# EAGLE design BusPirate-v4d (EAGLE 5.07)
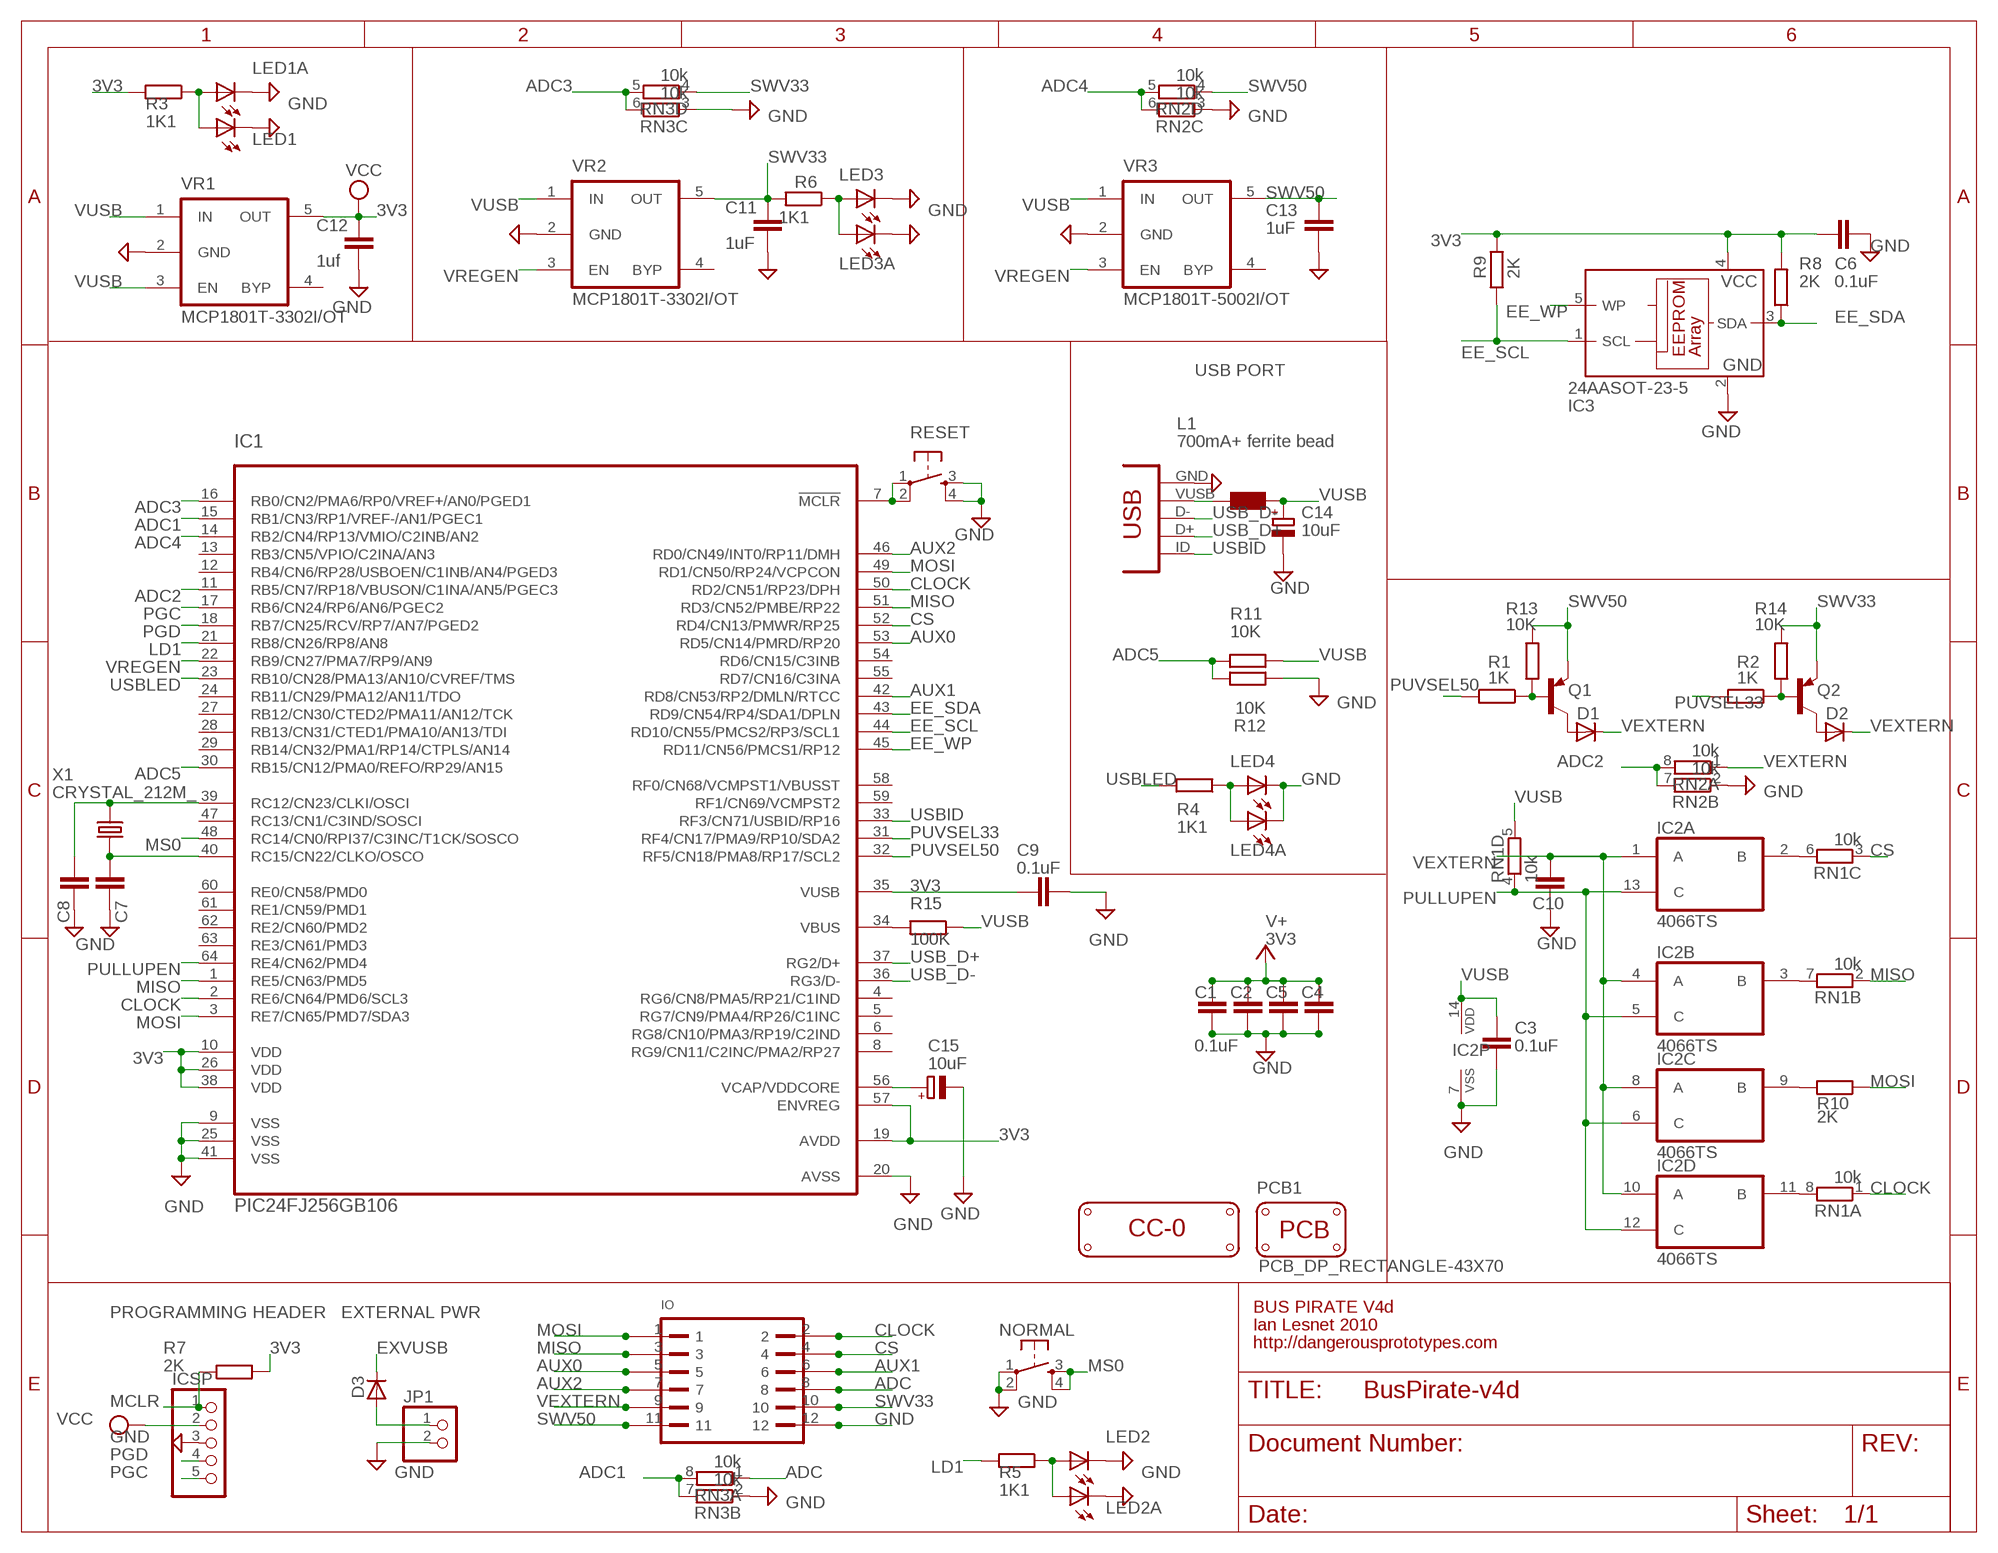
[diagram p0: schematic, sheet 1]

## Parts
C1  0.1uF  C-EUC0603  [C0603]
C2  0.1uF  C-EUC0603  [C0603]
C3  0.1uF  C-EUC0603  [C0603]
C4  0.1uF  C-EUC0603  [C0603]
C5  0.1uF  C-EUC0603  [C0603]
C6  0.1uF  C-EUC0603  [C0603]
C7  0.1uF  C-EUC0603  [C0603]
C8  0.1uF  C-EUC0603  [C0603]
C9  0.1uF  C-EUC0603  [C0603]
C10  0.1uF  C-EUC0603  [C0603]
C11  1uF  C-EUC0603  [C0603]
C12  1uf  C-EUC0603  [C0603]
C13  1uF  C-EUC0603  [C0603]
C14  10uF  CPOL-EUSMCA  [SMC_A]
C15  10uF  CPOL-EUSMCA  [SMC_A]
D1  MBR0520LT  [SOD123]
D2  MBR0520LT  [SOD123]
D3  MBR0520LT  [SOD123]
IC1  PIC24FJ256GB106  [TQFP64-10X10]
IC2  4066TS  [40XX_TSSOP14]
IC3  24AASOT-23-5  24AA  [SOT-23-5]
ICSP  PINHD-1X5  [1X05]
IO  PINSHRD-PTH-2X06  [PINSHRD_PTH_2X06]
JP1  PINHD-1X02_2.54-S  [1X02-S]
L1  700mA+ ferrite bead  WE-KIL_0805  [WE-KI_0805_B]
LED1  LEDCHIP-LED0805  [CHIP-LED0805]
LED1A  LEDCHIP-LED0805  [CHIP-LED0805]
LED2  LEDCHIP-LED0805  [CHIP-LED0805]
LED2A  LEDCHIP-LED0805  [CHIP-LED0805]
LED3  LEDCHIP-LED0805  [CHIP-LED0805]
LED3A  LEDCHIP-LED0805  [CHIP-LED0805]
LED4  LEDCHIP-LED0805  [CHIP-LED0805]
LED4A  LEDCHIP-LED0805  [CHIP-LED0805]
LOGO1  LOGO_CC-0  [LOGO_CC-0]
NORMAL  SMD_TACT_SMALL  [TACT_SWITCH_SMALL]
PCB1  PCB_DP_RECTANGLE-43X70  [DP7043_V1]
Q1  MMBTA56-SOT23  [SOT23]
Q2  MMBTA56-SOT23  [SOT23]
R1  1K  RESISTOR-0603  [R603]
R2  1K  R-EU_R0603  [R0603]
R3  1K1  RESISTOR-0603  [R603]
R4  1K1  RESISTOR-0603  [R603]
R5  1K1  RESISTOR-0603  [R603]
R6  1K1  RESISTOR-0603  [R603]
R7  2K  R-EU_R0603  [R0603]
R8  2K  R-EU_R0603  [R0603]
R9  2K  R-EU_R0603  [R0603]
R10  2K  R-EU_R0603  [R0603]
R11  10K  R-EU_R0603  [R0603]
R12  10K  R-EU_R0603  [R0603]
R13  10K  RESISTOR-0603  [R603]
R14  10K  R-EU_R0603  [R0603]
R15  100K  R-EU_R0603  [R0603]
RESET  SMD_TACT_SMALL  [TACT_SWITCH_SMALL]
RN1  10k  RNETWORK  [RN8P-4R-CRA06S]
RN2  10k  RNETWORK  [RN8P-4R-CRA06S]
RN3  10k  RNETWORK  [RN8P-4R-CRA06S]
USB  USB mini-b  CON-USB-MINI-BUSB1  [CONN_USB_MINI-B]
VR1  MCP1801T-3302I/OT  MIC5205  [SOT-23-5]
VR2  MCP1801T-3302I/OT  MIC5205  [SOT-23-5]
VR3  MCP1801T-5002I/OT  MIC5205  [SOT-23-5]
X1  CRYSTAL_212M_  [4X6]

## Nets
3V3: C1.1 C2.1 C4.1 C5.1 C6.1 C9.1 C12.1 IC1.10(VDD) IC1.19(AVDD) IC1.26(VDD) IC1.35(VUSB) IC1.38(VDD) IC1.57(ENVREG) IC3.4(VCC) ICSP.2 R3.2 R7.2 R8.2 R9.2 VR1.5(OUT) ; supply symbol labelled VCC, V+
ADC: IO.8 RN3.1
ADC1: IC1.15(RB1/CN3/RP1/VREF-/AN1/PGEC1) RN3.7 RN3.8
ADC2: IC1.11(RB5/CN7/RP18/VBUSON/C1INA/AN5/PGEC3) RN2.7 RN2.8
ADC3: IC1.16(RB0/CN2/PMA6/RP0/VREF+/AN0/PGED1) RN3.5 RN3.6
ADC4: IC1.14(RB2/CN4/RP13/VMIO/C2INB/AN2) RN2.5 RN2.6
ADC5: IC1.30(RB15/CN12/PMA0/REFO/RP29/AN15) R11.2 R12.2
AUX0: IC1.53(RD5/CN14/PMRD/RP20) IO.5
AUX1: IC1.42(RD8/CN53/RP2/DMLN/RTCC) IO.6
AUX2: IC1.46(RD0/CN49/INT0/RP11/DMH) IO.7
CLOCK: IC1.2(RE6/CN64/PMD6/SCL3) IC1.50(RD2/CN51/RP23/DPH) IO.2 RN1.1
CS: IC1.52(RD4/CN13/PMWR/RP25) IO.4 RN1.3
EE_SCL: IC1.44(RD10/CN55/PMCS2/RP3/SCL1) IC3.1(SCL) R9.1
EE_SDA: IC1.43(RD9/CN54/RP4/SDA1/DPLN) IC3.3(SDA) R8.1
EE_WP: IC1.45(RD11/CN56/PMCS1/RP12) IC3.5(WP)
EXVUSB: D3.C L1.2 USB.VUSB
GND: C1.2 C2.2 C3.2 C4.2 C5.2 C6.2 C7.2 C8.2 C9.2 C10.2 C11.2 C12.2 C13.2 C14.- C15.- IC1.9(VSS) IC1.20(AVSS) IC1.25(VSS) IC1.41(VSS) IC2.7(P:VSS) IC3.2(GND) ICSP.3 IO.12 JP1.2 LED1.C LED1A.C LED2.C LED2A.C LED3.C LED3A.C LED4.C LED4A.C NORMAL.1 NORMAL.2 R12.1 RESET.3 RESET.4 RN2.2 RN2.3 RN3.2 RN3.3 USB.GND VR1.2(GND) VR2.2(GND) VR3.2(GND)
LD1: IC1.21(RB8/CN26/RP8/AN8) R5.2
MCLR: IC1.7(!MCLR) ICSP.1 R7.1 RESET.1 RESET.2
MISO: IC1.1(RE5/CN63/PMD5) IC1.51(RD3/CN52/PMBE/RP22) IO.3 RN1.2
MOSI: IC1.3(RE7/CN65/PMD7/SDA3) IC1.49(RD1/CN50/RP24/VCPCON) IO.1 R10.1
MS0: IC1.48(RC14/CN0/RPI37/C3INC/T1CK/SOSCO) NORMAL.3 NORMAL.4
N$1: IC2.9(C:B) R10.2
N$2: IC2.11(D:B) RN1.8
N$3: D1.A Q1.3(C)
N$4: IC2.2(A:B) RN1.6
N$5: IC2.3(B:B) RN1.7
N$6: LED2.A LED2A.A R5.1
N$7: LED1.A LED1A.A R3.1
N$8: Q2.1(B) R2.1 R14.2
N$9: C7.1 IC1.40(RC15/CN22/CLKO/OSCO) X1.2(X2)
N$10: C15.+ IC1.56(VCAP/VDDCORE)
N$11: IC1.34(VBUS) R15.2
N$12: C8.1 IC1.39(RC12/CN23/CLKI/OSCI) X1.1(X1)
N$13: LED4.A LED4A.A R4.1
N$14: D2.A Q2.3(C)
N$15: D3.A JP1.1
N$17: Q1.1(B) R1.1 R13.2
N$18: LED3.A LED3A.A R6.1
PGC: IC1.17(RB6/CN24/RP6/AN6/PGEC2) ICSP.5
PGD: IC1.18(RB7/CN25/RCV/RP7/AN7/PGED2) ICSP.4
PULLUPEN: IC1.64(RE4/CN62/PMD4) IC2.5(B:C) IC2.6(C:C) IC2.12(D:C) IC2.13(A:C) RN1.4
PUVSEL33: IC1.31(RF4/CN17/PMA9/RP10/SDA2) R2.2
PUVSEL50: IC1.32(RF5/CN18/PMA8/RP17/SCL2) R1.2
SWV33: C11.1 IO.10 Q2.2(E) R6.2 R14.1 RN3.4 VR2.5(OUT)
SWV50: C13.1 IO.11 Q1.2(E) R13.1 RN2.4 VR3.5(OUT)
USB_D+: IC1.37(RG2/D+) USB.D+
USB_D-: IC1.36(RG3/D-) USB.D-
USBID: IC1.33(RF3/CN71/USBID/RP16) USB.ID(USBID)
USBLED: IC1.23(RB10/CN28/PMA13/AN10/CVREF/TMS) R4.2
VEXTERN: C10.1 D1.C D2.C IC2.1(A:A) IC2.4(B:A) IC2.8(C:A) IC2.10(D:A) IO.9 RN2.1
VREGEN: IC1.22(RB9/CN27/PMA7/RP9/AN9) VR2.3(EN) VR3.3(EN)
VUSB: C3.1 C14.+ IC2.14(P:VDD) L1.1 R11.1 R15.1 RN1.5 VR1.1(IN) VR1.3(EN) VR2.1(IN) VR3.1(IN)
Unconnected: IC1.4(RG6/CN8/PMA5/RP21/C1IND) IC1.5(RG7/CN9/PMA4/RP26/C1INC) IC1.6(RG8/CN10/PMA3/RP19/C2IND) IC1.8(RG9/CN11/C2INC/PMA2/RP27) IC1.12(RB4/CN6/RP28/USBOEN/C1INB/AN4/PGED3) IC1.13(RB3/CN5/VPIO/C2INA/AN3) IC1.24(RB11/CN29/PMA12/AN11/TDO) IC1.27(RB12/CN30/CTED2/PMA11/AN12/TCK) IC1.28(RB13/CN31/CTED1/PMA10/AN13/TDI) IC1.29(RB14/CN32/PMA1/RP14/CTPLS/AN14) IC1.47(RC13/CN1/C3IND/SOSCI) IC1.54(RD6/CN15/C3INB) IC1.55(RD7/CN16/C3INA) IC1.58(RF0/CN68/VCMPST1/VBUSST) IC1.59(RF1/CN69/VCMPST2) IC1.60(RE0/CN58/PMD0) IC1.61(RE1/CN59/PMD1) IC1.62(RE2/CN60/PMD2) IC1.63(RE3/CN61/PMD3) USB.BODY@1(BODY) USB.BODY@2(BODY) USB.BODY@3(BODY) USB.BODY@4(BODY) VR1.4(BYP) VR2.4(BYP) VR3.4(BYP)

## Notes on the sheet
- USB PORT
- BUS PIRATE V4d
- PROGRAMMING HEADER | EXTERNAL PWR
- Ian Lesnet 2010
- http://dangerousprototypes.com

## Library data of the parts
C1-C13 = rcl:C-EU: CAPACITOR, European symbol
C14 C15 = rcl:CPOL-EU: POLARIZED CAPACITOR, European symbol
D1-D3 = diode:MBR0520LT: SCHOTTKY BARRIER RECTIFIER Source: http://onsemi.com .. MBR0520LT1-D.pdf
IC1 = dp_devices:PIC24FJ256GB106: 16-Bit Flash Microcontroller with USB On-The-Go(OTG)
IC2 = 40xx:4066: Quad bilateral ANALOG SWITCH
IC3 = dp_devices:24AA*; 24AA: 24AA
ICSP = pinhead:PINHD-1X5: PIN HEADER
IO = dp_devices:PINSHRD-PTH-2X06: Shrouded pin header, 2.54mm pitch
JP1 = pinhead-2:PINHD-1X02: PIN HEADER
L1 = wuerth-elektronik:WE-KIL: SMD Wire Wound Ceramic Inductor WE-KIL - Low profile - High Q values -- Bluetooth -- Wireless LAN -- RF oscillation circuit -- IF impedance matching
LED1 LED1A LED2 LED2A LED3 LED3A LED4 LED4A = led:LED: LED OSRAM: - CHIPLED LG R971, LG N971, LY N971, LG Q971, LY Q971, LO R971, LY R971 LH N974, LH R974 LS Q976, LO Q976, LY Q976 LO Q996 - Hyper CHIPLED LW Q18S LB Q993, LB Q99A, LB R99A - SideLED LS A670, LO A670, LY A670, LG A670, LP A670 LB A673, LV A673, LT A673, LW A673 LH A674 LY A675 LS A676, LA A676, LO A676, LY A676, LW A676 LS A679, LY A679, LG A679 - Hyper Micro SIDELED® LS Y876, LA Y876, LO Y876, LY Y876 LT Y87S - SmartLED LW L88C, LW L88S LB L89C, LB L89S, LG L890 LS L89K, LO L89K, LY L89K LS L896, LA L896, LO L896, LY L896 - TOPLED LS T670, LO T670, LY T670, LG T670, LP T670 LSG T670, LSP T670, LSY T670, LOP T670, LYG T670 LG T671, LOG T671, LSG T671 LB T673, LV T673, LT T673, LW T673 LH T674 LS T676, LA T676, LO T676, LY T676, LB T676, LH T676, LSB T676, LW T676 LB T67C, LV T67C, LT T67C, LS T67K, LO T67K, LY T67K, LW E67C LS E67B, LA E67B, LO E67B, LY E67B, LB E67C, LV E67C, LT E67C LW T67C LS T679, LY T679, LG T679 LS T770, LO T770, LY T770, LG T770, LP T770 LB T773, LV T773, LT T773, LW T773 LH T774 LS E675, LA E675, LY E675, LS T675 LS T776, LA T776, LO T776, LY T776, LB T776 LHGB T686 LT T68C, LB T68C - Hyper Mini TOPLED® LB M676 - Mini TOPLED Santana® LG M470 LS M47K, LO M47K, LY M47K Source: http://www.osram.convergy.de LUXEON: - LUMILED® LXK2-PW12-R00, LXK2-PW12-S00, LXK2-PW14-U00, LXK2-PW14-V00 LXK2-PM12-R00, LXK2-PM12-S00, LXK2-PM14-U00 LXK2-PE12-Q00, LXK2-PE12-R00, LXK2-PE12-S00, LXK2-PE14-T00, LXK2-PE14-U00 LXK2-PB12-K00, LXK2-PB12-L00, LXK2-PB12-M00, LXK2-PB14-N00, LXK2-PB14-P00, LXK2-PB14-Q00 LXK2-PR12-L00, LXK2-PR12-M00, LXK2-PR14-Q00, LXK2-PR14-R00 LXK2-PD12-Q00, LXK2-PD12-R00, LXK2-PD12-S00 LXK2-PH12-R00, LXK2-PH12-S00 LXK2-PL12-P00, LXK2-PL12-Q00, LXK2-PL12-R00 Source: www.luxeon.com KINGBRIGHT: KA-3528ASYC Source: www.kingbright.com
LOGO1 = dp_devices:LOGO_CC-0
NORMAL RESET = dp_devices:SMD_TACT_SMALL
PCB1 = dp_devices:PCB_DP_RECTANGLE: Dangerous Prototypes Standard Rectangular PCB sizes
Q1 Q2 = transistor-pnp:*-?: PNP Transistor
R1 R3-R6 R13 = dp_devices:RESISTOR
R2 R7-R10 R14 R15 = rcl:R-EU_: RESISTOR, European symbol
R11 R12 = resistor:R-EU_: RESISTOR, European symbol
RN1-RN3 = dp_devices:RNETWORK: 4 Resistor Array 0603
USB = dp_devices:CON-USB-MINI-B: USB connector
VR1-VR3 = dp_devices:MIC5205: 150ma Low-Noise LDO Regulator
X1 = dp_devices:CRYSTAL_2

## Board
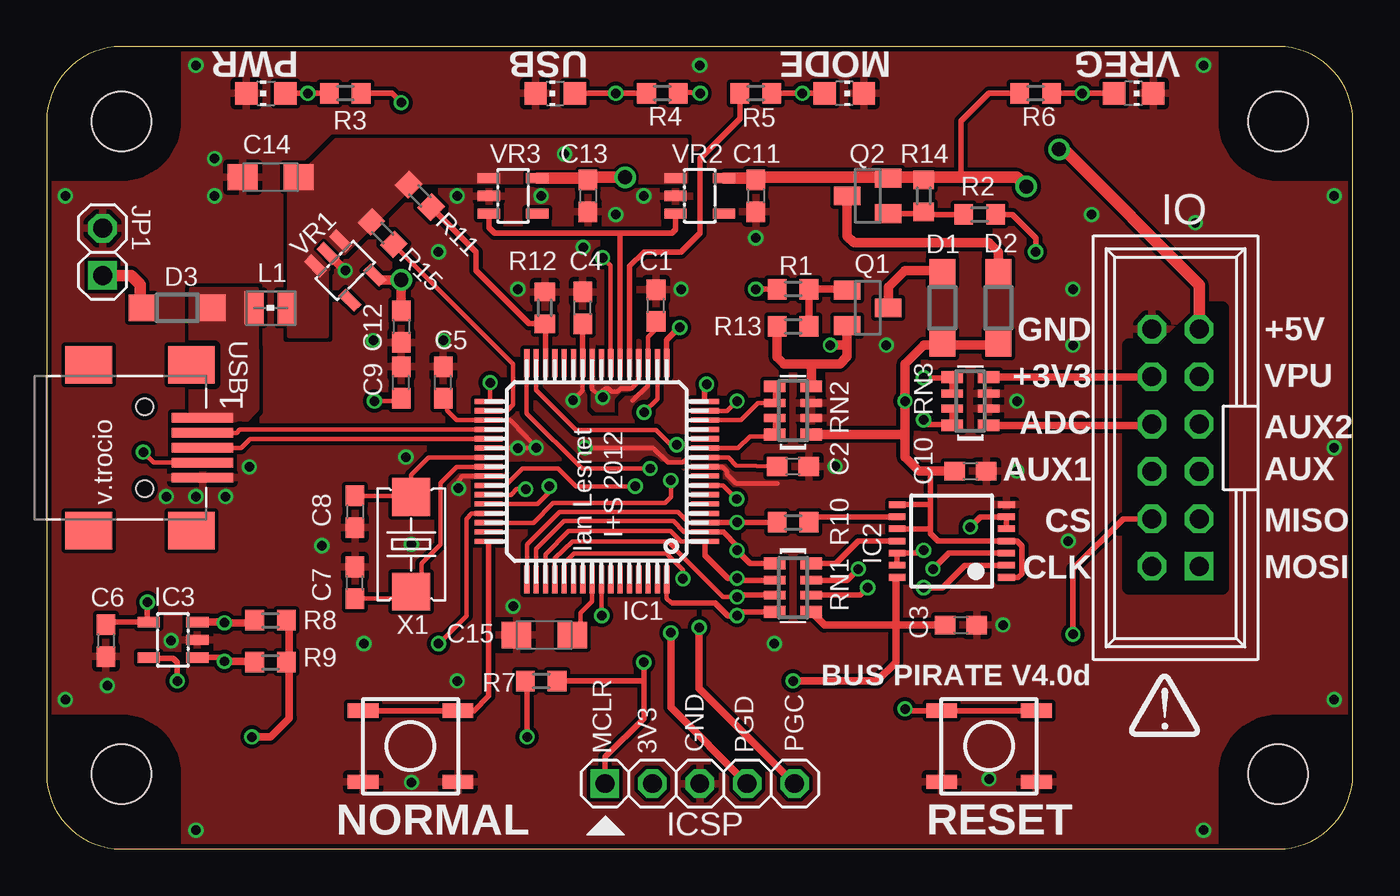
[diagram p1: board, top side]
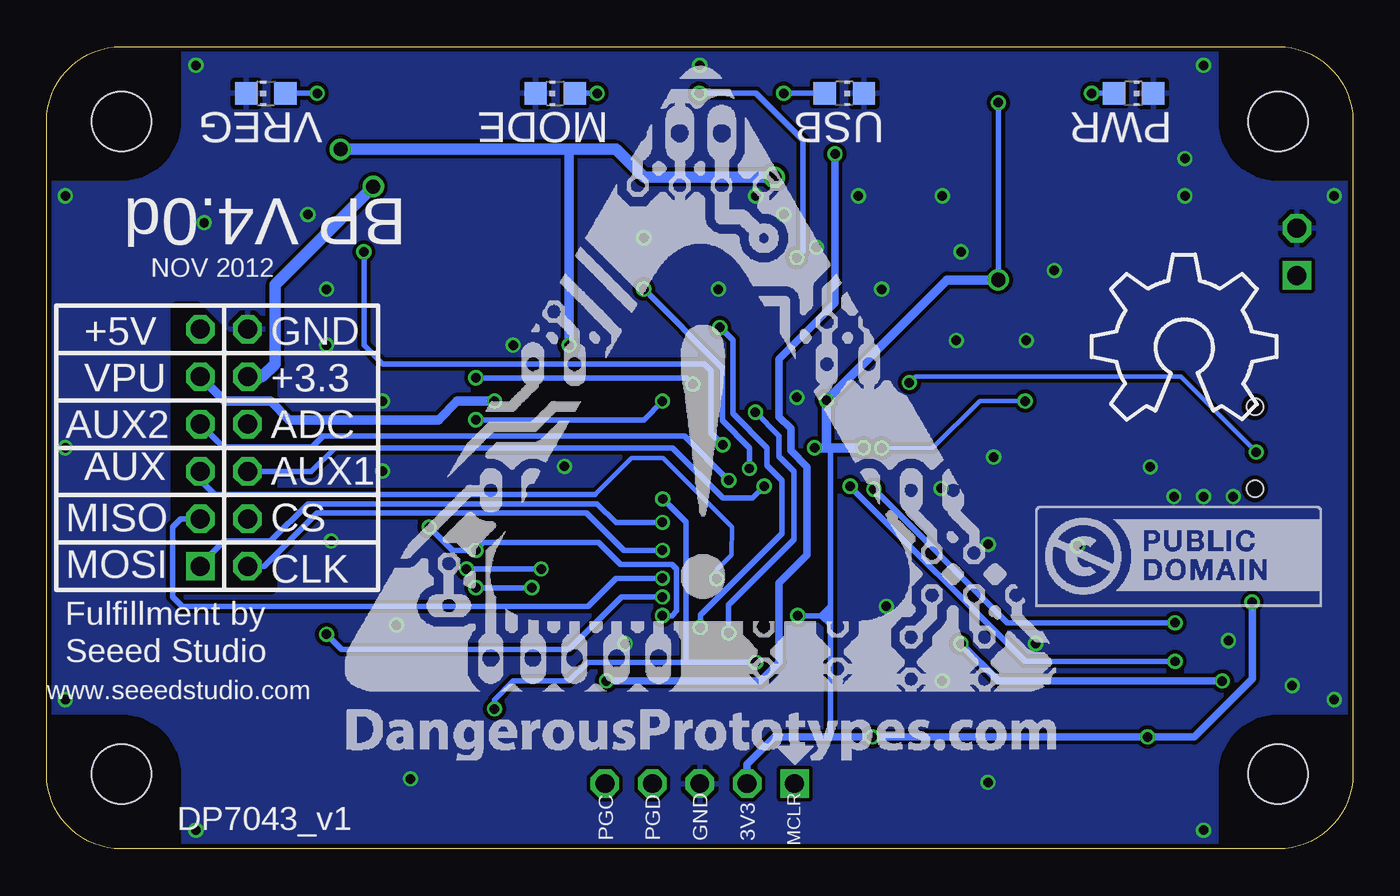
[diagram p2: board, bottom side, seen from below]

Size 70 x 43 mm. Coordinates in mm from the lower left corner, seen from the top.
Copper layers (1*16): Top 0.035mm / dielectric 1.5mm / Bottom 0.035mm
Design rules "Fusion_eagle_rule_v1.1": minimum track width 6mil, minimum drill 12mil, track to track 6mil, track to pad 6mil, pad to pad 6mil, via to via 6mil, smd to smd 0mil, copper to edge 10mil, drill to drill 10mil, minimum pad ring 10mil, minimum via ring 6mil, stop-mask expansion 2mil, vias tented up to drill 100mil, thermal gap 10mil
tRestrict: area 58,14 to 63,29
bRestrict: area 58,14 to 63,29

### Footprints (pad centres in the part's own frame; a part is rotated, then mirrored left to right if it is on the bottom)
C0603 = smd 1.1 x 1: 1 -0.85,0; 2 0.85,0
SMC_A = smd 1.6 x 1.4: + -1.5,0; - 1.5,0
SOD123 = smd 1.4 x 1.4: A 1.9,0; C -1.9,0
TQFP64-10X10 = smd 1.5 x 0.28: 1 -5.8,3.75; 2 -5.8,3.25; 3 -5.8,2.75; 4 -5.8,2.25; 5 -5.8,1.75; 6 -5.8,1.25; 7 -5.8,0.75; 8 -5.8,0.25; 9 -5.8,-0.25; 10 -5.8,-0.75; 11 -5.8,-1.25; 12 -5.8,-1.75; 13 -5.8,-2.25; 14 -5.8,-2.75; 15 -5.8,-3.25; 16 -5.8,-3.75; 33 5.8,-3.75; 34 5.8,-3.25; 35 5.8,-2.75; 36 5.8,-2.25; 37 5.8,-1.75; 38 5.8,-1.25; 39 5.8,-0.75; 40 5.8,-0.25; 41 5.8,0.25; 42 5.8,0.75; 43 5.8,1.25; 44 5.8,1.75; 45 5.8,2.25; 46 5.8,2.75; 47 5.8,3.25; 48 5.8,3.75 | smd 0.28 x 1.5: 17 -3.75,-5.8; 18 -3.25,-5.8; 19 -2.75,-5.8; 20 -2.25,-5.8; 21 -1.75,-5.8; 22 -1.25,-5.8; 23 -0.75,-5.8; 24 -0.25,-5.8; 25 0.25,-5.8; 26 0.75,-5.8; 27 1.25,-5.8; 28 1.75,-5.8; 29 2.25,-5.8; 30 2.75,-5.8; 31 3.25,-5.8; 32 3.75,-5.8; 49 3.75,5.8; 50 3.25,5.8; 51 2.75,5.8; 52 2.25,5.8; 53 1.75,5.8; 54 1.25,5.8; 55 0.75,5.8; 56 0.25,5.8; 57 -0.25,5.8; 58 -0.75,5.8; 59 -1.25,5.8; 60 -1.75,5.8; 61 -2.25,5.8; 62 -2.75,5.8; 63 -3.25,5.8; 64 -3.75,5.8
40XX_TSSOP14 = smd 0.35 x 0.9: 1 -1.95,-2.925; 2 -1.3,-2.925; 3 -0.65,-2.925; 4 0,-2.925; 5 0.65,-2.925; 6 1.3,-2.925; 7 1.95,-2.925; 8 1.95,2.925; 9 1.3,2.925; 10 0.65,2.925; 11 0,2.925; 12 -0.65,2.925; 13 -1.3,2.925; 14 -1.95,2.925
SOT-23-5 = smd 0.55 x 1.2: 1 -0.95,-1.3; 2 0,-1.3; 3 0.95,-1.3; 4 0.95,1.3; 5 -0.95,1.3
1X05 = drill 1.016 square: 1 -5.08,0 | drill 1.016 octagon: 2 -2.54,0; 3 0,0; 4 2.54,0; 5 5.08,0
PINSHRD_PTH_2X06 = drill 1.016 square: 1 -6.35,-1.27 | drill 1.016 octagon: 2 -6.35,1.27; 3 -3.81,-1.27; 4 -3.81,1.27; 5 -1.27,-1.27; 6 -1.27,1.27; 7 1.27,-1.27; 8 1.27,1.27; 9 3.81,-1.27; 10 3.81,1.27; 11 6.35,-1.27; 12 6.35,1.27
1X02-S = drill 1.016 square: 1 -1.27,0 | drill 1.016 octagon: 2 1.27,0
WE-KI_0805_B = smd 1.02 x 1.78: 1 -0.89,0; 2 0.89,0
CHIP-LED0805 = smd 1.2 x 1.2: A 0,-1.05; C 0,1.05
TACT_SWITCH_SMALL@1 = smd 1.651 x 0.762: 1 -2.54,1.905; 2 2.54,1.905; 3 -2.54,-1.905; 4 2.54,-1.905
DP7043_V1 = hole 3.2: 4,4; 66,4; 66,39; 4,39
SOT23 = smd 1 x 1.4: 1 -0.95,-1.1; 2 0.95,-1.1; 3 0,1.1
R603 = smd 1 x 1.1: 1 -0.85,0; 2 0.85,0
R0603 = smd 1 x 1.1: 1 -0.85,0; 2 0.85,0
RN8P-4R-CRA06S = smd 0.63 x 1.15: 1 -1.295,-0.975; 4 1.295,-0.975; 5 1.295,0.975; 8 -1.295,0.975 | smd 0.44 x 1.15: 2 -0.4,-0.975; 3 0.4,-0.975; 6 0.4,0.975; 7 -0.4,0.975
CONN_USB_MINI-B = smd 2 x 2.5: BODY@1 -4.45,2.5; BODY@2 4.45,2.5; BODY@3 4.45,-3; BODY@4 -4.45,-3 | smd 0.5 x 3.3: D+ 0,3.1; D- -0.8,3.1; GND 1.6,3.1; ID 0.8,3.1; VUSB -1.6,3.1 | hole 0.9: -2.2,0; 2.2,0
4X6@1 = smd 2.032 x 2.032: 1 -2.54,0; 2 2.54,0

### Placement (x,y rotation side)
C1  32.66,29.12 90 top
C2  40,20.5 0 top
C3  49,12 0 top
C4  28.73,29 90 top
C5  21.25,25 90 top
C6  3.17,11.16 270 top
C7  16.53,14.26 90 top
C8  16.53,18.07 270 top
C9  19,25 90 top
C10  49.5,20.25 0 top
C11  38,35 270 top
C12  19,28 270 top
C13  29,35 270 top
C14  12,36 180 top
C15  26.67,11.46 180 top
D1  48,29 90 top
D2  51,29 90 top
D3  7,29 180 top
IC1  29.48,20.23 180 top
IC2  48.5,16.5 90 top
IC3  6.77,11.2 90 top
ICSP  35,3.5 0 top
IO  60.5,21.5 90 top
JP1  3,32 90 top
L1  12,29 180 top
LED1  11.75,40.5 90 top
LED1A  11.75,40.5 270 bottom
LED2  42.75,40.5 270 top
LED2A  42.75,40.5 90 bottom
LED3  58.25,40.5 270 top
LED3A  58.25,40.5 90 bottom
LED4  27.25,40.5 90 top
LED4A  27.25,40.5 270 bottom
LOGO1  17,13 0 bottom
NORMAL  SMD_TACT_SMALL  [TACT_SWITCH_SMALL@1]  19.5,5.5 180 top
PCB1  0,0 0 top
Q1  44,29 270 top
Q2  44,35 90 top
R1  40,30 180 top
R2  50,34 0 top
R3  16,40.5 0 top
R4  33,40.5 0 top
R5  38,40.5 180 top
R6  53,40.5 180 top
R7  26.5,9 180 top
R8  12,12.25 0 top
R9  12,10 0 top
R10  40,17.5 0 top
R11  20,35 315 top
R12  26.7,29 270 top
R13  40,28 0 top
R14  47,35 270 top
R15  18,33 315 top
RESET  SMD_TACT_SMALL  [TACT_SWITCH_SMALL@1]  50.5,5.5 0 top
RN1  40,14 270 top
RN2  40,23.5 90 top
RN3  49.5,24 90 top
U$1  [DP-LOGO]  58,6 0 top
U$2  [OSHW_8X350_NOTEXT]  14,23 0 bottom
U$4  [DP_LOGO_ART_1.5X1.5]  54,4.75 0 bottom
USB  5.25,21.5 270 top
VR1  16,31 225 top
VR2  35,35 270 top
VR3  25,35 270 top
X1  CRYSTAL_212M_  [4X6@1]  19.54,16.32 270 top

### Tracks (layer width: path | path; a pad name or v marks a point on that pad's centre or on a via)
3V3  (via drill 0.51, 0.76)
  Top 0.254: 21.38,24.04 C5.1 21.46,24.18 21.46,23.48 21.97,22.98 IC1.35 24.82,22.98 25.67,22.14 v26.23,21.5 | C1.1 32.66,27.85 32.23,27.43 IC1.19 32.23,24.84 31.39,24.04 | C2.1 36.94,20.55 36.53,20.98 IC1.10 34.36,20.98 34.08,20.71 33.29,20.71 32.5,21.5 v28.84,21.5 | v26.23,21.5 25.51,21.48 v25.25,21.48 | v25.25,21.48 25.49,21.48 v26.23,21.5 | v25.25,21.48 IC1.38 | IC1.26 28.73,24.56 v28.21,24.04 | IC1.57 29.73,12.49 v29.75,12.5 | v17.56,24 18.85,24 C9.1
  Top 0.305: C6.1 3.32,12.15 IC3.4 5.4,12.22 v5.4,13.22 | R3.2 18.5,40.5 v19,40 | IC1.26 C4.1 | 25.5,8.85 R7.2 25.75,8.9 v25.75,6
  Top 0.406: R8.2 13,12 13,10.15 R9.2 13,9.85 13,7 12,6 v11,6
  Top 0.508: VR1.5 17.84,30.5 v19,30.5 C12.1
  Bottom 0.254: v25.25,21.48 22.52,21.48 20,24 v17.56,24
  Bottom 0.305: 28,12.5 28,13 | 28.5,12.5 28,12.5 | 28.5,12.5 v29.75,12.5 | 28.5,12.5 28,13 | 28,12 28.5,12.5 | v19,30.5 v19,40 | 28,6 28,12 | 28,12 28,12.5 | 28,13 28,21.5
  Bottom 0.406: v5.4,13.22 5.4,9.1 8.5,6 v11,6 v25.75,6 28,6 31,6 32.46,4.54 ICSP.2
  Bottom 0.508: 28.21,21.5 v28.21,24.04 | v26.23,21.5 28,21.5 28.21,21.5 | v28.21,24.04 | 28.21,21.5 v28.84,21.5 | 28.21,21.5 v28.21,24.04 | v19,30.5 21.75,30.5 v28.21,24.04
  pour Top (isolate 0.254, no thermals): 25.67,27.21 28.21,27.21 28.84,26.58 28.84,23.41 29.16,23.09 30.75,23.09 30.75,23.88 31.54,24.68 33.92,24.68 33.92,20.86 23.77,20.86 23.77,23.41 25.67,23.41
ADC
  Top 0.406: RN3.1 59.16,22.7 IO.8
ADC1  (via drill 0.51)
  Top 0.254: IC1.15 36.47,23.48 v37,24
  Top 0.305: RN3.7 RN3.8 48.48,22.75 47.25,22.75 v47,23
  Bottom 0.305: v47,23 38,23 v37,24
ADC2
  Top 0.254: RN2.7 RN2.8 38.66,22.11 37.69,22.11 37.06,21.48 IC1.11
ADC3  (via drill 0.51)
  Top 0.254: IC1.16 35.25,24
  Top 0.305: RN3.6 RN3.5 48.45,25.25 v47,25.25 | 35.25,24 35.25,24.78 v35.37,24.9
  Bottom 0.305: v47,25.25 35.72,25.25 v35.37,24.9
ADC4
  Top 0.254: RN2.5 RN2.6 38.12,23.9 37.2,22.98 IC1.14
ADC5
  Top 0.254: R11.2
  Top 0.305: R11.2 23,32 23,31 25.85,28.15 R12.2 26.73,28.13 IC1.30
AUX0  (via drill 0.51)
  Top 0.254: IC1.53 27.73,15.3 28.27,15.84 33.21,15.84 34.1,14.94 v34.1,14.48
  Bottom 0.254: v34.1,14.48 34.1,14.94 33.29,15.75 33.27,17.26 36.97,20.96 38.66,20.96 40.62,19
  Bottom 0.305: IO.5 61.77,19.77 61,19 40.62,19
AUX1  (via drill 0.51)
  Top 0.254: IC1.42 24.6,19.48 25.51,20.39 27.42,20.39 28.37,19.44 v31.54,19.44
  Bottom 0.305: v31.54,19.44 32.18,18.8 33.77,18.8 36.47,21.5 54.55,21.5 55.82,20.23 IO.6
AUX2  (via drill 0.51)
  Top 0.254: IC1.46 26.09,17.48 27.15,18.54 33.13,18.54 33.45,18.85 v33.45,19.75
  Bottom 0.305: v33.45,19.75 35.83,22.14 55.19,22.14 55.78,21.54 60.54,21.54 IO.7
CLOCK  (via drill 0.51)
  Top 0.254: IC1.50 26.23,16.08 27.73,17.58 33.58,17.58 34.16,16.98 IC1.2 36,16.98
  Top 0.305: RN1.1 37.7,15.29 v37,16 37,16.25 36.27,16.98 36,16.98
  Bottom 0.305: IO.2 58.35,15.15 55.5,18 41.06,18 39.06,16 v37,16
CS  (via drill 0.51)
  Top 0.254: IC1.52 27.23,15.57 28.17,16.47 33.29,16.47 33.78,15.98 33.78,15.97 36.25,13.5 v37,13.5
  Top 0.305: RN1.3 37.1,13.6 v37,13.5 | v55,11.5 55,15 57.69,17.69 IO.4
  Bottom 0.305: v37,13.5 39.2,13.5 42,10.71 54.2,10.71 v55,11.5
EE_SCL  (via drill 0.51)
  Top 0.254: v26.94,19.44 26.94,19.12 26.3,18.48 IC1.44
  Top 0.305: IC3.1 9.32,10.25 v9.53,10.05
  Top 0.406: v9.53,10.05 11.1,10.05 R9.1
  Bottom 0.305: v9.53,10.05 17.55,10.05 v26.94,19.44
EE_SDA  (via drill 0.51)
  Top 0.254: IC1.43 24.9,18.98 25.19,19.28 v25.67,19.28
  Top 0.406: IC3.3 9.49,12.15 v9.53,12.11 11.04,12.11 R8.1
  Bottom 0.305: v9.53,12.11 18.5,12.11 v25.67,19.28
EE_WP  (via drill 0.51)
  Top 0.254: IC1.45 22.79,17.98 22.5,17.69 22.5,12.49 v21,11 | 5.51,10.21 IC3.5
  Top 0.305: 5.51,10.21 6.79,10.21 7,10 v7,9
  Bottom 0.406: v7,9 19,9 v21,11
EXVUSB
  pour Top (isolate 0.305, no thermals): 7.72,24.68 8.99,24.68 8.99,27.21 7.72,27.21 7.72,29.75 7.75,30 11.25,30 11.28,23.56 10.55,22.83 7.72,22.83
GND  (via drill 0.51)
  Top 0.254: IC1.25 29.23,24.61 v29.8,24.2 29.8,24.56 29.92,24.68 30.11,24.68 30.27,24.52 30.59,24.52 30.75,24.68 31.34,24.68 31.73,25.06 IC1.20 | IC1.41 22.3,19.98 22.07,19.75 v22.07,19.32 | IC1.9 36.22,20.48 36.47,20.23 36.47,20.07 36.94,19.59 39.16,19.59
  Top 0.508: VR1.2 | VR1.2 v16,31
  other vias: 52,20.25 61.56,33.56 26.5,35 21,32 35,42 34,30 9,35 56,34 42.25,20.5 30.5,34 21.25,27.25 9,37 25,13 17.5,27.25 19.54,16.32 19.55,3.56 45,27 1,35 55,30 1,8 54.75,16.5 69,35 62,42 38,32.75 8,1 39,11 55,27 8,18.88 6.67,11.16 22,9 14.75,16.25 69,8 62,1 8,42 9.59,18.88 10.86,20.47 6.41,18.88 3.25,8.75 50.5,3.75 32,35 19.25,21 17,11 69,21.5 51.25,12 25.25,30 28.75,32.25 22,35 52,24
  pour Top (isolate 0.203, rank 2): 0,43 70,43 70,0 0,0
  pour Bottom (isolate 0.203, rank 2): 0,43 70,43 arc-3 70,0 0,0
LD1
  Top 0.254: IC1.21 31.23,26.75 | R5.2 37.46,40.19
  Top 0.305: 31.23,26.75 31.23,31.23 32,32 34,32 35,33 35,37 37.15,39.15 R5.2
MCLR  (via drill 0.51)
  Top 0.254: IC1.7 36.26,19.48 v36.98,18.75
  Top 0.305: 32,9 32,7 29.92,4.92 ICSP.1 | 32,9 v32,10 | 32,9 R7.1 | RESET.2 RESET.1 46.09,7.41 v46,7.5
  Bottom 0.305: v36.98,18.75 35.75,17.52 35.75,10 | v46,7.5 46,8 45,9 42,9 41,10 35.75,10 | v32,10 35.75,10
MISO  (via drill 0.51)
  Top 0.254: IC1.51 26.73,15.79 27.98,17.04 33.43,17.04 33.99,16.48 IC1.1 35.28,16.45
  Top 0.305: RN1.2 37.1,14.4 v37,14.5 36.5,14.5 35.28,15.72 35.28,16.45
  Bottom 0.305: v37,14.5 39.5,14.5 41,13 62.75,13 63.25,13.5 63.25,17.25 62.81,17.69 IO.3
MOSI  (via drill 0.51)
  Top 0.254: IC1.49 25.73,14.42 25.75,14.47 25.75,16.31 27.5,18.06 33.83,18.06 34.41,17.48 IC1.3 35.98,17.48
  Top 0.305: R10.1 v37,17.5 36,17.5 35.98,17.48
  Bottom 0.305: IO.1 61.77,15.23 60.5,16.5 58,16.5 56,18.5 40.5,18.5 39.5,17.5 v37,17.5
MS0
  Top 0.254: 23.77,16.46 23.7,16.46 IC1.48
  Top 0.305: NORMAL.4 NORMAL.3 22.91,7.41 23.7,8.2 23.7,16.46
N$1
  Top 0.305: IC2.9 41.15,17.8 R10.2
N$2
  Top 0.305: IC2.11 43.5,16.5 42.3,15.29 RN1.8
N$3
  Top 0.508: Q1.3 45.1,30.1 46,31 47.9,31 D1.A
N$4  (via drill 0.51)
  Top 0.305: RN1.6 43.6,13.6 v44,14 | v47,14 48,14 49.2,15.2 IC2.2
  Bottom 0.305: v44,14 v47,14
N$5  (via drill 0.51)
  Top 0.305: IC2.3 48.35,15.85 v47.5,15 | RN1.7 42.9,14.4 v43.5,15
  Bottom 0.305: v43.5,15 v47.5,15
N$6  (via drill 0.51)
  Top 0.305: R5.1 v40.5,40.5 LED2A.A
  Bottom 0.305: v40.5,40.5 LED2A.A
N$7  (via drill 0.51)
  Top 0.305: R3.1 v14,40.5 LED1A.A
  Bottom 0.305: LED1A.A v14,40.5
N$8
  Top 0.305: R2.1 47.15,34 R14.2 46.9,34.05 Q2.1
N$9
  Top 0.254: X1.2 19.7,13.63 | C7.1 19.17,13.41 X1.2 | X1.2 20.09,14.34 20.09,15.3 21.11,16.32 21.11,19.62 21.97,20.48 IC1.40
N$10
  Top 0.254: IC1.56 29.23,13.26 28.62,12.65 28.62,11.9 C15.+
N$11
  Top 0.254: IC1.34 24.67,23.48 25,23.81 25,26 R15.2
N$12
  Top 0.254: C8.1 19.49,18.92 X1.1 19.54,20.04 20.48,20.98 IC1.39
N$13  (via drill 0.51)
  Top 0.305: R4.1 v30.5,40.5 LED4A.A
  Bottom 0.305: LED4A.A v30.5,40.5
N$14
  Top 0.508: Q2.3 42.9,32.85 43.25,32.5 50.5,32.5 51,32 D2.A
N$15
  Top 0.61: JP1.1 4.52,30.73 5,30.25 5,29.1 D3.A
N$17
  Top 0.406: R13.2 R1.1 42.85,30 Q1.1
N$18  (via drill 0.51)
  Top 0.305: R6.1 v55.5,40.5 LED3A.A
  Bottom 0.305: v55.5,40.5 LED3A.A
PGC  (via drill 0.51)
  Top 0.305: IC1.17 33.23,27.28 33.9,27.94 v33.92,27.94 v33.92,27.95
  Top 0.406: v34.97,11.86 34.97,8.61 ICSP.5
  Bottom 0.305: v34.97,11.86 34.97,12.53 30.59,16.91 30.59,19.75 31.39,20.55 31.39,21.5 33.23,23.34 33.23,27.28 33.9,27.94 v33.92,27.94 v33.92,27.95
PGD  (via drill 0.51)
  Top 0.254: v32.02,23.41 32.73,24.11 IC1.18
  Top 0.406: v33.45,11.58 33.45,7.59 ICSP.4
  Bottom 0.305: v32.02,23.41 30.75,22.14 30.75,21.02 29.96,20.23 29.96,16.58 33.45,13.09 v33.45,11.58
PULLUPEN  (via drill 0.51)
  Top 0.254: 33.55,13.18 33.49,13.18 33.23,13.44 IC1.64
  Top 0.305: IC2.13 IC2.12 46.85,15.85 v47,16 | IC2.5 IC2.6 50.05,17.8 v49.5,17.25 | 33.55,13.18 35.82,13.18 36.5,12.5 v37,12.5 37.2,12.71 RN1.4
  Bottom 0.305: v49.5,17.25 48.25,16 v47,16 46.58,16.42 40.42,16.42 39.25,15.25 36.5,15.25 36.25,15 36.25,12.75 36.5,12.5 v37,12.5
PUVSEL33  (via drill 0.51)
  Top 0.254: IC1.31 26.23,24.59 28.37,22.45 32.66,22.45 33.45,21.66 v33.77,21.66
  Top 0.305: R2.2 51.75,34 53,32.75 v53,32
  Bottom 0.305: v33.77,21.66 34.4,22.29 34.4,25.65 34.75,26 52,26 53,27 v53,32
PUVSEL50  (via drill 0.51)
  Top 0.254: IC1.32 25.73,23.34 28.69,20.39 v32.34,20.39
  Top 0.305: v38,30 R1.2
  Bottom 0.305: v32.34,20.39 32.34,21.5 33.78,22.95 33.78,25.8 33.8,25.8 v38,30
SWV33  (via drill 0.76)
  Top 0.305: R6.2 50.5,40.5 49,39 49,36 | Q2.2 45.05,35.95 45,36
  Top 0.406: RN3.4 59.22,25.3 IO.10
  Top 0.508: 47,36 R14.1
  Top 0.61: VR2.5 37.9,35.95 C11.1 38,36 45,36 45.05,36 | 45.05,36 Q2.2 | 45.05,36 47,36 49,36 52,36 v52.5,35.5
  Bottom 0.61: v52.5,35.5 57.75,30.25 57.75,26 58.44,25.31 IO.10
SWV50  (via drill 0.51, 0.76)
  Top 0.508: C13.1 29,36 | 42.9,27 42.9,26.4 42.5,26 41,26 | 42.9,27 Q1.2 | RN2.4 40.98,25.98 41,26 | v42,27 42.9,27 | R13.1 39.15,26.35 39.5,26 41,26
  Top 0.61: 29,36 v31,36 | VR3.5 28.9,35.95 C13.1 | IO.11 61.77,30.23 54.5,37.5 v54.25,37.5
  Bottom 0.508: 42,37.5 v42,27
  Bottom 0.61: v31,36 38,36 39.5,37.5 42,37.5 v54.25,37.5
USB_D+
  Top 0.254: IC1.37 10.9,21.98 10.42,21.5 USB.D+
USB_D-
  Top 0.254: USB.D- 10.18,22.3 10.36,22.48 IC1.36
USBID  (via drill 0.51)
  Top 0.254: v23.77,24.99 23.77,24.07 IC1.33 | USB.ID 5.74,20.7 v5.18,21.27
  Bottom 0.254: v5.18,21.27 9.22,25.31 23.45,25.31 v23.77,24.99
USBLED  (via drill 0.51)
  Top 0.254: IC1.23 30.23,31.25 v29.8,31.69
  Top 0.305: v35.03,40.5 34.1,40.55 R4.2
  Bottom 0.254: v29.8,31.69 29.48,32.01
  Bottom 0.305: 29.48,32.01 29.48,38 31.98,40.5 v35.03,40.5
VEXTERN  (via drill 0.51)
  Top 0.254: 47.35,18.5 47.3,18.45
  Top 0.305: IC2.1 52.05,14.55 52.25,14.75 52.25,16.25 52,16.5 IC2.4 47.75,16.5 47.35,16.89 47.35,17.15 | 47.35,18.45 47.35,18.5 47.35,20.25 | IC2.10 47.35,17.15 | 47.35,18.45 IC2.8 | 47.35,17.15 47.35,18.45
  Top 0.508: D2.C 51,27 48.1,27 D1.C 47.9,27 47,27 46,26 v46,24 46,22.25 | C10.1 47.35,20.25 46.75,20.25 46,21 46,22.25 | RN2.1 45.95,22.2 46,22.25
  Bottom 0.508: v46,24 48,24 49,23 57,23 58,24 60.46,24 IO.9
VREGEN
  Top 0.254: 30.73,26.75 IC1.22
  Top 0.305: 30.73,33 30.73,26.75 | VR3.3 23.7,33.3 24,33 30.73,33 | VR2.3 33.7,33.2 33.5,33 30.73,33
VUSB  (via drill 0.51)
  Top 0.305: IC2.14 45.55,14.55 45.5,14.5
  Top 0.406: 45.5,12 41.68,12 RN1.5 | 45.5,12 C3.1 | 45.5,12 45.5,14.5 | v40,9 44.5,9 45.5,10 45.5,12
  Bottom 0.406: v40,9 31.75,9 30.75,10 30.75,14.25 29.25,15.75 29.25,20.48 30.11,21.34 30.11,22.52 30.75,23.16 30.75,26.25 27.75,29.25 v27.75,37.25
  pour Top (no thermals): 15.5,38 34.25,38 34.25,35.75 19.75,35.75 15,31 15,27.5 13,27.5 13,35.5

### Text on the board
tPlace: v.trocio | I+S 2012 | Ian Lesnet | MCLR | 3V3 | GND | PGD | PGC
bPlace: NOV 2012
tNames: PWR | USB | MODE | VREG | GND | +5V | +3V3 | VPU | ADC | AUX2 | AUX1 | AUX | CS | MISO | CLK | MOSI | BUS PIRATE V4.0d
bNames: PWR | USB | MODE | VREG | BP V4.0d | GND | +5V | +3.3 | VPU | ADC | AUX2 | AUX1 | AUX | CS | MISO | CLK | MOSI | Fulfillment by | Seeed Studio | www.seeedstudio.com | MCLR | 3V3 | GND | PGD | PGC
tValues: vimark
Reference: EXT PWR | USB-OTG | V+ - GND | I/O header | GND | +5v | +3v | Vpu | USB | ADC | AUX2 | AUX1 | AUX | CS | MISO | CLK | MOSI | MCLR | +3.3V | GND | DATA | CLOCK | BUS PIRATE V4.0d | CC-0 | Ian Lesnet NOV 2012 | Programming Header | http://dangerousprototypes.com